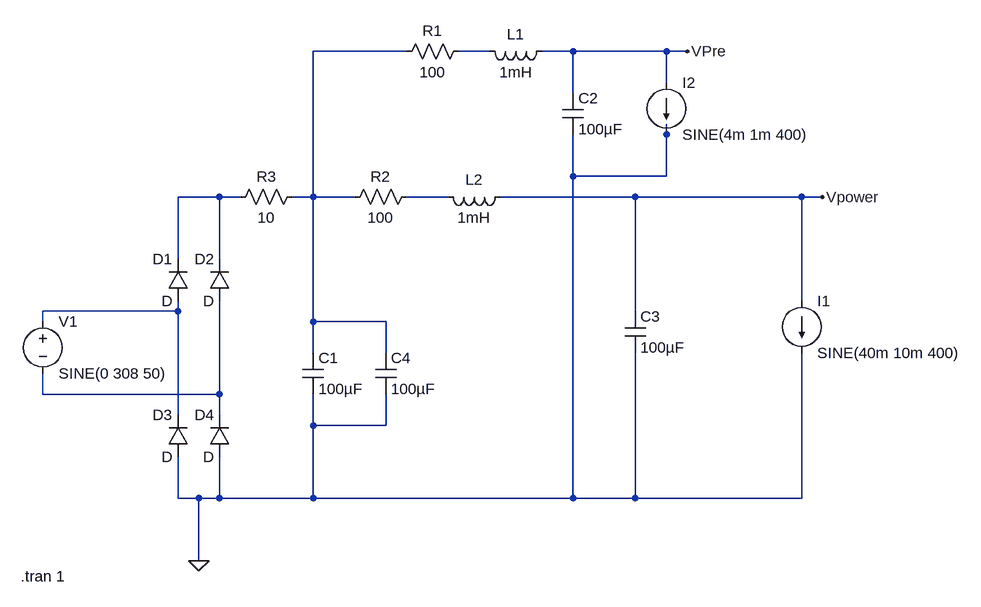
[diagram p0: schematic HV_PowerSupply.asc]
HV_PowerSupply.asc, the LTspice schematic file:
Version 4
SHEET 1 2196 984
WIRE 560 -288 416 -288
WIRE 688 -288 640 -288
WIRE 816 -288 768 -288
WIRE 960 -288 816 -288
WIRE 992 -288 960 -288
WIRE 960 -240 960 -288
WIRE 816 -224 816 -288
WIRE 960 -160 960 -176
WIRE 816 -96 816 -160
WIRE 960 -96 960 -160
WIRE 960 -96 816 -96
WIRE 272 -64 208 -64
WIRE 304 -64 272 -64
WIRE 416 -64 416 -288
WIRE 416 -64 384 -64
WIRE 480 -64 416 -64
WIRE 624 -64 560 -64
WIRE 912 -64 704 -64
WIRE 1168 -64 912 -64
WIRE 1200 -64 1168 -64
WIRE 208 32 208 -64
WIRE 272 32 272 -64
WIRE 1168 96 1168 -64
WIRE 208 112 208 96
WIRE 208 112 0 112
WIRE 912 112 912 -64
WIRE 0 128 0 112
WIRE 416 128 416 -64
WIRE 528 128 416 128
WIRE 416 176 416 128
WIRE 528 176 528 128
WIRE 0 240 0 208
WIRE 272 240 272 96
WIRE 272 240 0 240
WIRE 208 272 208 112
WIRE 272 272 272 240
WIRE 416 288 416 240
WIRE 528 288 528 240
WIRE 528 288 416 288
WIRE 208 400 208 336
WIRE 240 400 208 400
WIRE 272 400 272 336
WIRE 272 400 240 400
WIRE 416 400 416 288
WIRE 416 400 272 400
WIRE 816 400 816 -96
WIRE 816 400 416 400
WIRE 912 400 912 176
WIRE 912 400 816 400
WIRE 1168 400 1168 176
WIRE 1168 400 912 400
WIRE 240 496 240 400
FLAG 240 496 0
FLAG 992 -288 VPre
FLAG 1200 -64 Vpower
SYMBOL voltage 0 112 R0
WINDOW 123 0 0 Left 0
WINDOW 39 24 124 Left 2
SYMATTR InstName V1
SYMATTR Value SINE(0 308 50)
SYMBOL diode 224 96 R180
WINDOW 0 24 64 Left 2
WINDOW 3 24 0 Left 2
SYMATTR InstName D1
SYMBOL diode 288 96 R180
WINDOW 0 24 64 Left 2
WINDOW 3 24 0 Left 2
SYMATTR InstName D2
SYMBOL diode 224 336 R180
WINDOW 0 24 64 Left 2
WINDOW 3 24 0 Left 2
SYMATTR InstName D3
SYMBOL diode 288 336 R180
WINDOW 0 24 64 Left 2
WINDOW 3 24 0 Left 2
SYMATTR InstName D4
SYMBOL cap 400 176 R0
SYMATTR InstName C1
SYMATTR Value 100µF
SYMBOL ind 784 -304 R90
WINDOW 0 5 56 VBottom 2
WINDOW 3 32 56 VTop 2
SYMATTR InstName L1
SYMATTR Value 1mH
SYMATTR SpiceLine Rser=0.4
SYMBOL cap 800 -224 R0
SYMATTR InstName C2
SYMATTR Value 100µF
SYMBOL current 1168 96 R0
WINDOW 123 0 0 Left 0
WINDOW 39 0 0 Left 0
SYMATTR InstName I1
SYMATTR Value SINE(40m 10m 400)
SYMBOL res 656 -304 R90
WINDOW 0 0 56 VBottom 2
WINDOW 3 32 56 VTop 2
SYMATTR InstName R1
SYMATTR Value 100
SYMBOL res 576 -80 R90
WINDOW 0 0 56 VBottom 2
WINDOW 3 32 56 VTop 2
SYMATTR InstName R2
SYMATTR Value 100
SYMBOL ind 720 -80 R90
WINDOW 0 5 56 VBottom 2
WINDOW 3 32 56 VTop 2
SYMATTR InstName L2
SYMATTR Value 1mH
SYMATTR SpiceLine Rser=0.4
SYMBOL cap 896 112 R0
SYMATTR InstName C3
SYMATTR Value 100µF
SYMBOL res 400 -80 R90
WINDOW 0 0 56 VBottom 2
WINDOW 3 32 56 VTop 2
SYMATTR InstName R3
SYMATTR Value 10
SYMBOL cap 512 176 R0
SYMATTR InstName C4
SYMATTR Value 100µF
SYMBOL current 960 -240 R0
WINDOW 123 0 0 Left 0
WINDOW 39 0 0 Left 0
SYMATTR InstName I2
SYMATTR Value SINE(4m 1m 400)
TEXT -34 520 Left 2 !.tran 1

The netlist it stands for:
* HV_PowerSupply.asc
V1 N005 N006 SINE(0 308 50)
D1 N005 N003 D
D2 N006 N003 D
D3 0 N005 D
D4 0 N006 D
C1 N001 0 100µF
L1 VPre N002 1mH Rser=0.4
C2 VPre 0 100µF
I1 Vpower 0 SINE(40m 10m 400)
R1 N002 N001 100
R2 N004 N001 100
L2 Vpower N004 1mH Rser=0.4
C3 Vpower 0 100µF
R3 N001 N003 10
C4 N001 0 100µF
I2 VPre 0 SINE(4m 1m 400)
.model D D
.lib standard.dio
.tran 1
.backanno
.end